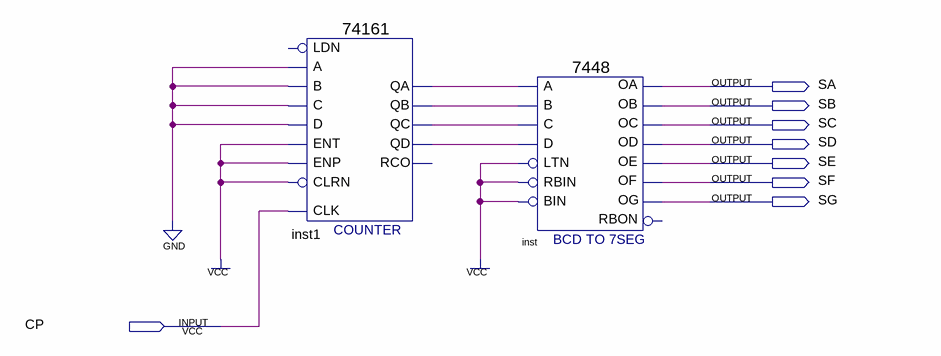
[diagram p0: schematic sheet]
// Quartus schematic bcd-decoder.bdf as structural Verilog: 2 symbols, 8 pins
module \bcd-decoder  (
  input  CP,
  output SA,
  output SB,
  output SC,
  output SD,
  output SE,
  output SF,
  output SG
);

  wire inst1_qa, inst1_qb, inst1_qc, inst1_qd;

  \74161  inst1 (
    .CLRN(1'b1), .CLK(CP), .ENP(1'b1), .A(1'b0), .D(1'b0), .ENT(1'b1), .B(1'b0), .C(1'b0), .QD(inst1_qd),
    .QC(inst1_qc), .QB(inst1_qb), .QA(inst1_qa));  // open: LDN, RCO
  \7448  inst (
    .A(inst1_qa), .C(inst1_qc), .D(inst1_qd), .B(inst1_qb), .RBIN(1'b1), .BIN(1'b1), .LTN(1'b1), .OC(SC),
    .OE(SE), .OD(SD), .OF(SF), .OG(SG), .OB(SB), .OA(SA));  // open: RBON
endmodule
